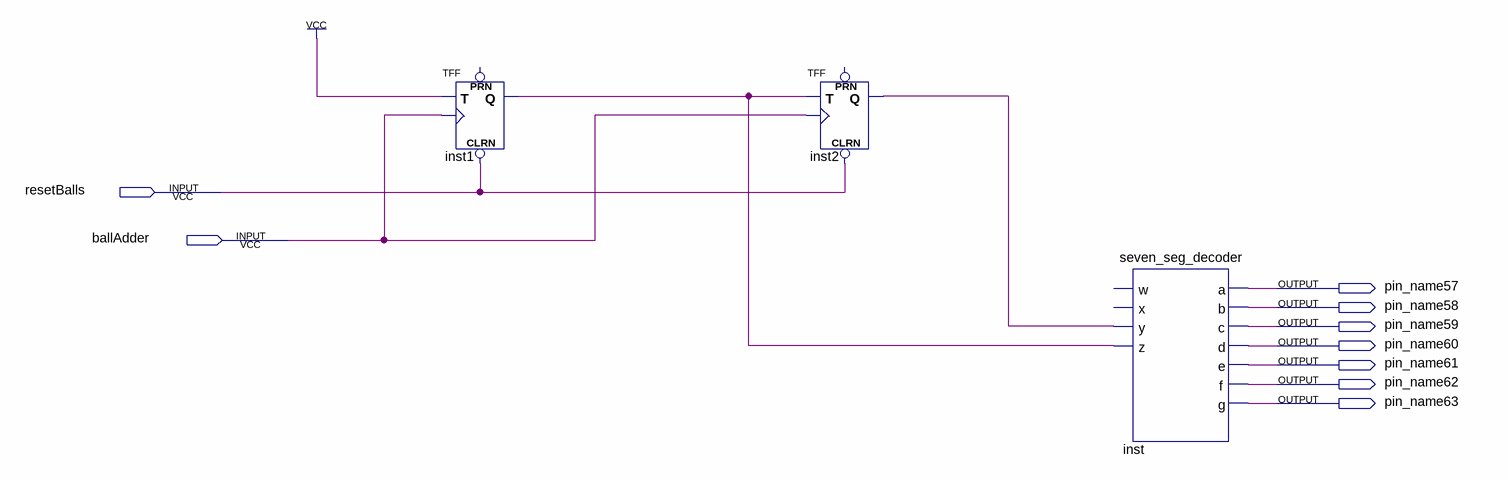
[diagram p0: schematic sheet]
// Quartus schematic ballsCounter.bdf as structural Verilog: 3 symbols, 9 pins
module ballsCounter (
  input  resetBalls,
  input  ballAdder,
  output pin_name57,
  output pin_name58,
  output pin_name59,
  output pin_name60,
  output pin_name61,
  output pin_name62,
  output pin_name63
);

  wire inst1_q, inst2_q;

  TFF inst1 (.CLRN(resetBalls), .T(1'b1), .CLK(ballAdder), .Q(inst1_q));  // open: PRN
  TFF inst2 (.CLRN(resetBalls), .T(inst1_q), .CLK(ballAdder), .Q(inst2_q));  // open: PRN
  seven_seg_decoder inst (
    .y(inst2_q), .z(inst1_q), .a(pin_name57), .b(pin_name58), .c(pin_name59), .d(pin_name60), .e(pin_name61),
    .f(pin_name62), .g(pin_name63));  // open: w, x
endmodule
